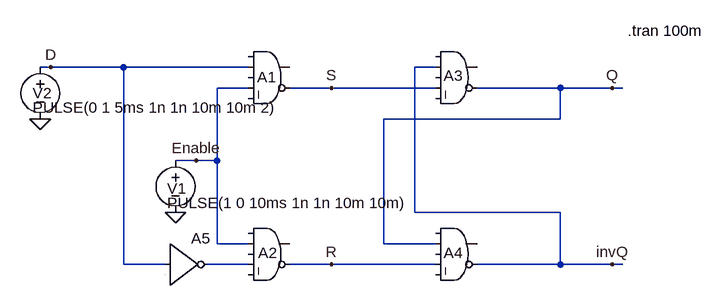
[diagram p0: schematic pregunta6.asc]
pregunta6.asc, the LTspice schematic file:
Version 4
SHEET 1 948 680
WIRE -64 128 -80 128
WIRE 48 128 -64 128
WIRE 240 128 48 128
WIRE 528 128 496 128
WIRE 240 160 192 160
WIRE 368 160 304 160
WIRE 528 160 368 160
WIRE 720 160 592 160
WIRE 800 160 720 160
WIRE 816 160 800 160
WIRE 720 208 720 160
WIRE 720 208 448 208
WIRE 160 272 128 272
WIRE 192 272 192 160
WIRE 192 272 160 272
WIRE 496 352 496 128
WIRE 720 352 496 352
WIRE 192 400 192 272
WIRE 240 400 192 400
WIRE 448 400 448 208
WIRE 528 400 448 400
WIRE 48 432 48 128
WIRE 112 432 48 432
WIRE 240 432 176 432
WIRE 368 432 304 432
WIRE 528 432 368 432
WIRE 720 432 720 352
WIRE 720 432 592 432
WIRE 800 432 720 432
WIRE 816 432 800 432
FLAG 368 160 S
FLAG 368 432 R
FLAG 800 160 Q
FLAG 800 432 invQ
FLAG -64 128 D
FLAG 160 272 Enable
FLAG -80 208 0
FLAG 128 352 0
SYMBOL Digital/and 272 80 R0
WINDOW 0 -18 63 Left 2
SYMATTR InstName A1
SYMBOL Digital/and 272 352 R0
WINDOW 0 -17 62 Left 2
SYMATTR InstName A2
SYMBOL Digital/and 560 352 R0
WINDOW 0 -19 62 Left 2
SYMATTR InstName A4
SYMBOL voltage 128 256 R0
WINDOW 0 -13 59 Left 2
WINDOW 3 -13 81 Left 2
SYMATTR InstName V1
SYMATTR Value PULSE(1 0 10ms 1n 1n 10m 10m)
SYMBOL voltage -80 112 R0
WINDOW 0 -12 56 Left 2
WINDOW 3 -12 78 Left 2
SYMATTR InstName V2
SYMATTR Value PULSE(0 1 5ms 1n 1n 10m 10m 2)
SYMBOL Digital/and 560 80 R0
WINDOW 0 -19 61 Left 2
SYMATTR InstName A3
SYMBOL Digital/inv 112 368 R0
SYMATTR InstName A5
TEXT 824 72 Left 2 !.tran 100m

The netlist it stands for:
* pregunta6.asc
A1 0 D 0 Enable 0 S 0 0 AND
A2 0 Enable 0 N001 0 R 0 0 AND
A4 0 Q 0 R 0 invQ 0 0 AND
V1 Enable 0 PULSE(1 0 10ms 1n 1n 10m 10m)
V2 D 0 PULSE(0 1 5ms 1n 1n 10m 10m 2)
A3 0 invQ 0 S 0 Q 0 0 AND
A5 D 0 0 0 0 N001 0 0 BUF
.tran 100m
.backanno
.end